# Altium schematic sheet NB3000_OneWire.SchDoc
size A; Organization: Altium Limited; Address1: L3, 12a Rodborough Rd; Address2: Frenchs Forest; Address3: NSW; Address4: Australia 2086
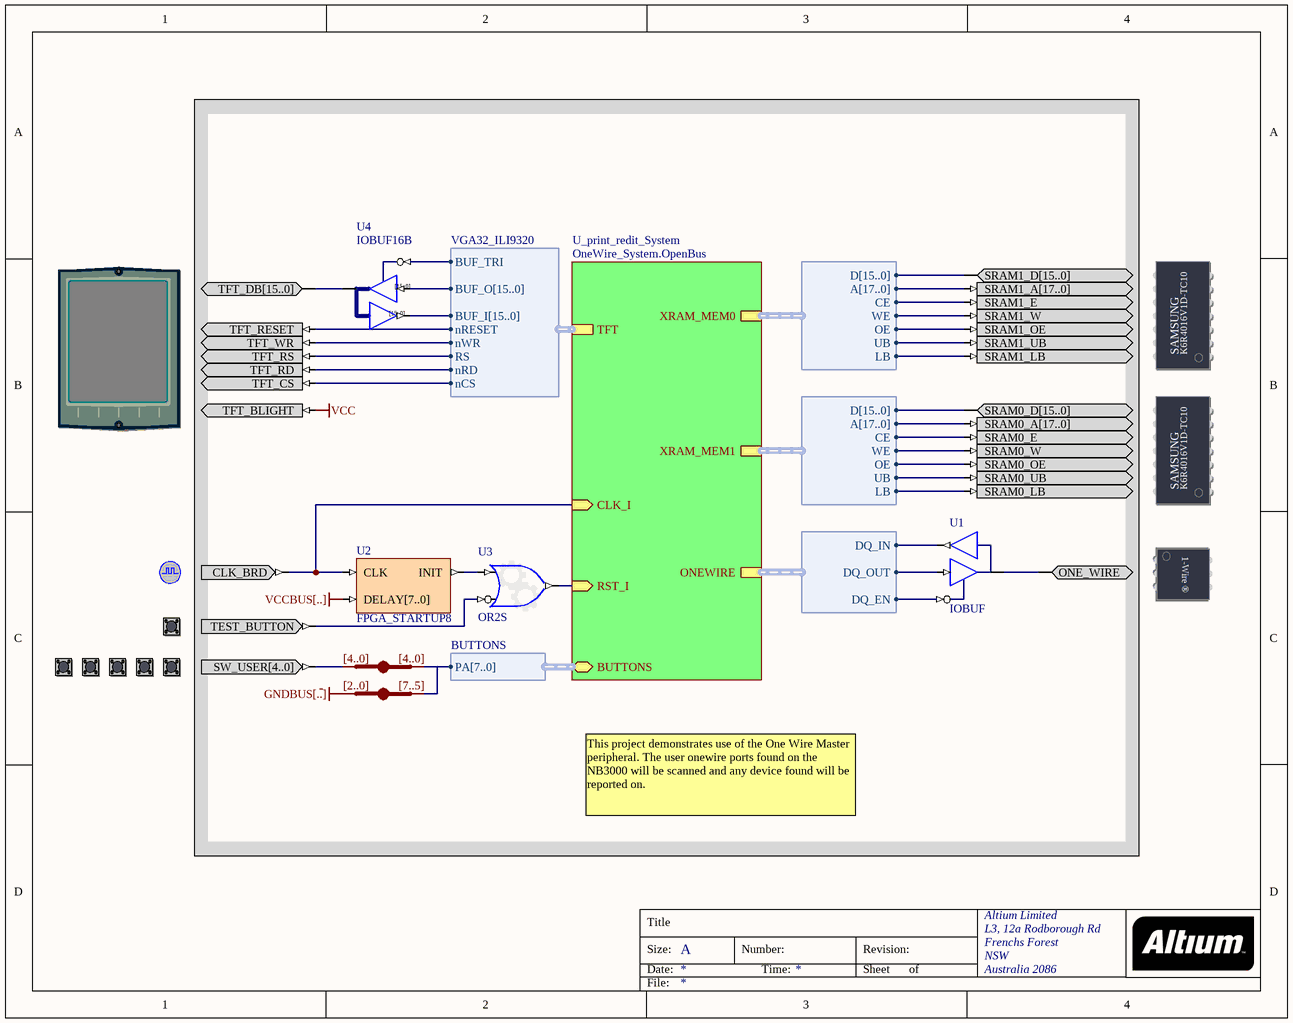
[diagram p0: NB3000_OneWire.SchDoc]

## Parts
(Parts that share a designator on the sheet are numbered #1, #2 ... from top to bottom, then left to right.)
?#1  SRAM_DAUGHTER1  (value not drawn)
?#2  TFT_LCD  (value not drawn)
?#3  SRAM_DAUGHTER0  (value not drawn)
?#4  CLOCK_BOARD  (value not drawn)
?#5  ONE_WIRE  (value not drawn)
?#6  TEST_BUTTON  (value not drawn)
?#7  USER_BUTTONS  (value not drawn)
JB_AUTO?#1  IndexA: [4..0]  (hidden comment: JB)
JB_AUTO?#2  IndexA: [2..0]  IndexB: [7..5]  (hidden comment: JB)
U1  IOBUF
U2  FPGA_STARTUP8
U3  OR2S
U4  IOBUF16B

## Sub-sheets
U_print_redit_System = OneWire_System.OpenBus: CLK_I (in), RST_I (in), ONEWIRE (harness WB_OWM), TFT (harness VGA32_ILI9320), XRAM_MEM0 (harness WB_MEM_CTRL_SRAM16_A18), XRAM_MEM1 (harness WB_MEM_CTRL_SRAM16_A18), BUTTONS (harness BUTTONS)

## Harnesses
WB_MEM_CTRL_SRAM16_A18: D[15..0], A[17..0], CE, WE, OE, UB, LB
WB_OWM: DQ_IN, DQ_OUT, DQ_EN
VGA32_ILI9320: BUF_TRI, BUF_O[15..0], BUF_I[15..0], nRESET, nWR, RS, nRD, nCS
BUTTONS: PA[7..0]

## Nets
GNDBUS[.~{.}]: JB_AUTO?#2.A[0..0]
VCC: ?#2.TFT_BLIGHT
VCCBUS[..]: U2.DELAY[7..0]
Net?#1_SRAM1_A[17..0]: ?#1.SRAM1_A[17..0] ; sheet U_print_redit_System/XRAM_MEM0.A[17..0]
Net?#1_SRAM1_D[15..0]: ?#1.SRAM1_D[15..0] ; sheet U_print_redit_System/XRAM_MEM0.D[15..0]
Net?#1_SRAM1_E: ?#1.SRAM1_E ; sheet U_print_redit_System/XRAM_MEM0.CE
Net?#1_SRAM1_LB: ?#1.SRAM1_LB ; sheet U_print_redit_System/XRAM_MEM0.LB
Net?#1_SRAM1_OE: ?#1.SRAM1_OE ; sheet U_print_redit_System/XRAM_MEM0.OE
Net?#1_SRAM1_UB: ?#1.SRAM1_UB ; sheet U_print_redit_System/XRAM_MEM0.UB
Net?#1_SRAM1_W: ?#1.SRAM1_W ; sheet U_print_redit_System/XRAM_MEM0.WE
Net?#2_TFT_CS: ?#2.TFT_CS ; sheet U_print_redit_System/TFT.nCS
Net?#2_TFT_DB[15..0]: ?#2.TFT_DB[15..0] U4.IO[15..0]
Net?#2_TFT_RD: ?#2.TFT_RD ; sheet U_print_redit_System/TFT.nRD
Net?#2_TFT_RESET: ?#2.TFT_RESET ; sheet U_print_redit_System/TFT.nRESET
Net?#2_TFT_RS: ?#2.TFT_RS ; sheet U_print_redit_System/TFT.RS
Net?#2_TFT_WR: ?#2.TFT_WR ; sheet U_print_redit_System/TFT.nWR
Net?#3_SRAM0_A[17..0]: ?#3.SRAM0_A[17..0] ; sheet U_print_redit_System/XRAM_MEM1.A[17..0]
Net?#3_SRAM0_D[15..0]: ?#3.SRAM0_D[15..0] ; sheet U_print_redit_System/XRAM_MEM1.D[15..0]
Net?#3_SRAM0_E: ?#3.SRAM0_E ; sheet U_print_redit_System/XRAM_MEM1.CE
Net?#3_SRAM0_LB: ?#3.SRAM0_LB ; sheet U_print_redit_System/XRAM_MEM1.LB
Net?#3_SRAM0_OE: ?#3.SRAM0_OE ; sheet U_print_redit_System/XRAM_MEM1.OE
Net?#3_SRAM0_UB: ?#3.SRAM0_UB ; sheet U_print_redit_System/XRAM_MEM1.UB
Net?#3_SRAM0_W: ?#3.SRAM0_W ; sheet U_print_redit_System/XRAM_MEM1.WE
Net?#4_CLK_BRD: ?#4.CLK_BRD U2.CLK ; sheet U_print_redit_System/CLK_I
Net?#5_ONE_WIRE: ?#5.ONE_WIRE U1.IO
Net?#6_TEST_BUTTON: ?#6.TEST_BUTTON U3.I1
Net?#7_SW_USER[4..0]: ?#7.SW_USER[4..0] JB_AUTO?#1.A[0..0]
NetJB_AUTO?#1_B[0..0]: JB_AUTO?#1.B[0..0] JB_AUTO?#2.B[0..0] ; sheet U_print_redit_System/BUTTONS.PA[7..0]
NetU1_I: U1.I ; sheet U_print_redit_System/ONEWIRE.DQ_OUT
NetU1_O: U1.O ; sheet U_print_redit_System/ONEWIRE.DQ_IN
NetU1_T: U1.T ; sheet U_print_redit_System/ONEWIRE.DQ_EN
NetU2_INIT: U2.INIT U3.I0
NetU3_O: U3.O ; sheet U_print_redit_System/RST_I
NetU4_I[15..0]: U4.I[15..0] ; sheet U_print_redit_System/TFT.BUF_O[15..0]
NetU4_O[15..0]: U4.O[15..0] ; sheet U_print_redit_System/TFT.BUF_I[15..0]
NetU4_T: U4.T ; sheet U_print_redit_System/TFT.BUF_TRI

## Notes on the sheet
- This project demonstrates use of the One Wire Master peripheral. The user onewire ports found on the NB3000 will be scanned and any device found will be reported on.
- Title
- Size:
- Date:
- A
- Number:
- Time:
- Revision:
- Sheet
- of
- File:
- (in symbol IOBUF16B) [15..0]
- (in symbol ONE_WIRE) 1-Wire ®
- (in symbol SRAM_DAUGHTER0) SAMSUNG; K6R4016V1D-TC10
- (in symbol SRAM_DAUGHTER1) SAMSUNG; K6R4016V1D-TC10

## Library data of the parts
?#1 = SRAM_DAUGHTER1: Free Static RAM - Daughterboard; PortComponent: True; Published: 14-May-2007; Publisher: Altium Limited; HelpURL: TR0149 Technical Reference for Altium's Xilinx Spartan-3 Daughter Board DB30.pdf#page=16
?#2 = TFT_LCD: TFT LCD Panel; PortComponent: True; Published: 22-Jan-2007; Publisher: Altium Limited; HelpURL: https://wiki.altium.com/display/ADOH/NanoBoard+3000+-+TFT+LCD+Panel+%28with+Touch+Screen%29
?#3 = SRAM_DAUGHTER0: Free Static RAM - Daughterboard; PortComponent: True; Published: 14-May-2007; Publisher: Altium Limited; HelpURL: TR0149 Technical Reference for Altium's Xilinx Spartan-3 Daughter Board DB30.pdf#page=16
?#4 = CLOCK_BOARD: Global System Clock Supply; PortComponent: True; Published: 19-Nov-2003; Publisher: Altium Limited; HelpURL: TR0143 Technical Reference Manual for Altium's Desktop NanoBoard NB2DSK01.pdf#page=41; UseInDSF: True
?#5 = ONE_WIRE: Peripheral Board One Wire; PortComponent: True; Published: 25-June-2007; Publisher: Altium Limited; HelpURL: TR0143 Technical Reference Manual for Altium's Desktop NanoBoard NB2DSK01.pdf#page=39
?#6 = TEST_BUTTON: Test / Reset Button; PortComponent: True; Published: 19-Nov-2003; Publisher: Altium Limited; HelpURL: TR0143 Technical Reference Manual for Altium's Desktop NanoBoard NB2DSK01.pdf#page=53
?#7 = USER_BUTTONS: Generic User Buttons; PortComponent: True; Published: 16-Apr-2007; Publisher: Altium Limited; HelpURL: https://wiki.altium.com/display/ADOH/NanoBoard+3000+-+Generic+User+Switches
JB_AUTO?#1 JB_AUTO?#2 = JB: System BUS Joiner; Published: 29-Jan-2004; Publisher: Altium Limited; LastRevisionNo: 1.00.00; HelpURL: CR0118 FPGA Generic Library Guide.pdf#page=297; FunctionalClass: Bus Joiner
  JB_AUTO?#1: IndexB: [4..0]
U1 = IOBUF: Input/Output Buffer; Enable: Low; Control: Common Control T; ArchiveName: GENERIC; VHDLIB_SIM: GENERIC_LIB; Published: 29-Jan-2004; Publisher: Altium Limited; XilinxEquivalent: IOBUF; LastRevisionNo: 1.00.00; HelpURL: CR0118 FPGA Generic Library Guide.pdf#page=293; ComponentLink1URL: CR0125 FPGA Buffer Resource Usage.pdf#page=78; ComponentLink1Description: Core &Resource Usage; FunctionalClass: Buffer; SubClass: IOBUF
U2 = FPGA_STARTUP8: FPGA Startup With 8 Bit Delay; Published: 9-Dec-2004; Publisher: Altium Limited; HelpURL: CR0119 FPGA_STARTUPx Powerup Delay Unit.pdf; LastRevisionNo: 1.00.00; ComponentLink1Description: Core &Resource Usage; ComponentLink1URL: CR0139 FPGA Peripheral Resource Usage.pdf#page=11
U3 = GATE: Configurable Generic Gate; ConfiguratorName: GENERIC_GATE; ConfigurationParameters: {}Version[1.0]{}GateKind[OR]{}BusInput[False]{}GateInputType[Bit]{}GateOutputOption[Normal]{}BusWidth[8]{}RegisterOutputs[False]{}NegativeClockEdge[False]{}InputCount[2]{}InputInvert0[False]{}InputInvert1[True]{}; LastRevisionNo: 1.00.00; Published: 3-Sep-2008; Publisher: Altium Limited
U4 = IOBUF16B: 16-Bit Input/Output Buffer, Bus Version; SubClass: IOBUF; Enable: Low; Control: Common Control T; PortSize: 16; ArchiveName: GENERIC; VHDLIB_SIM: GENERIC_LIB; Published: 29-Jan-2004; Publisher: Altium Limited; LastRevisionNo: 1.00.00; HelpURL: CR0118 FPGA Generic Library Guide.pdf#page=293; ComponentLink1URL: CR0125 FPGA Buffer Resource Usage.pdf#page=91; ComponentLink1Description: Core &Resource Usage; FunctionalClass: Buffer; PortStyle: Bus Version